# Altium schematic sheet HDMI.SchDoc: HDMI
size A3; Date: 01-DEC-2013; CompanyName: STMicroelectronics; Organization: Microcontrollers Division; Address1: 12, Rue Jules HOROWITZ; Address2: 38019 Grenoble; Address3: FRANCE; DocumentNumber: MB1272; Revision: A-01; SheetNumber: 10; SheetTotal: 18; Project: STM32MP25-DISCO
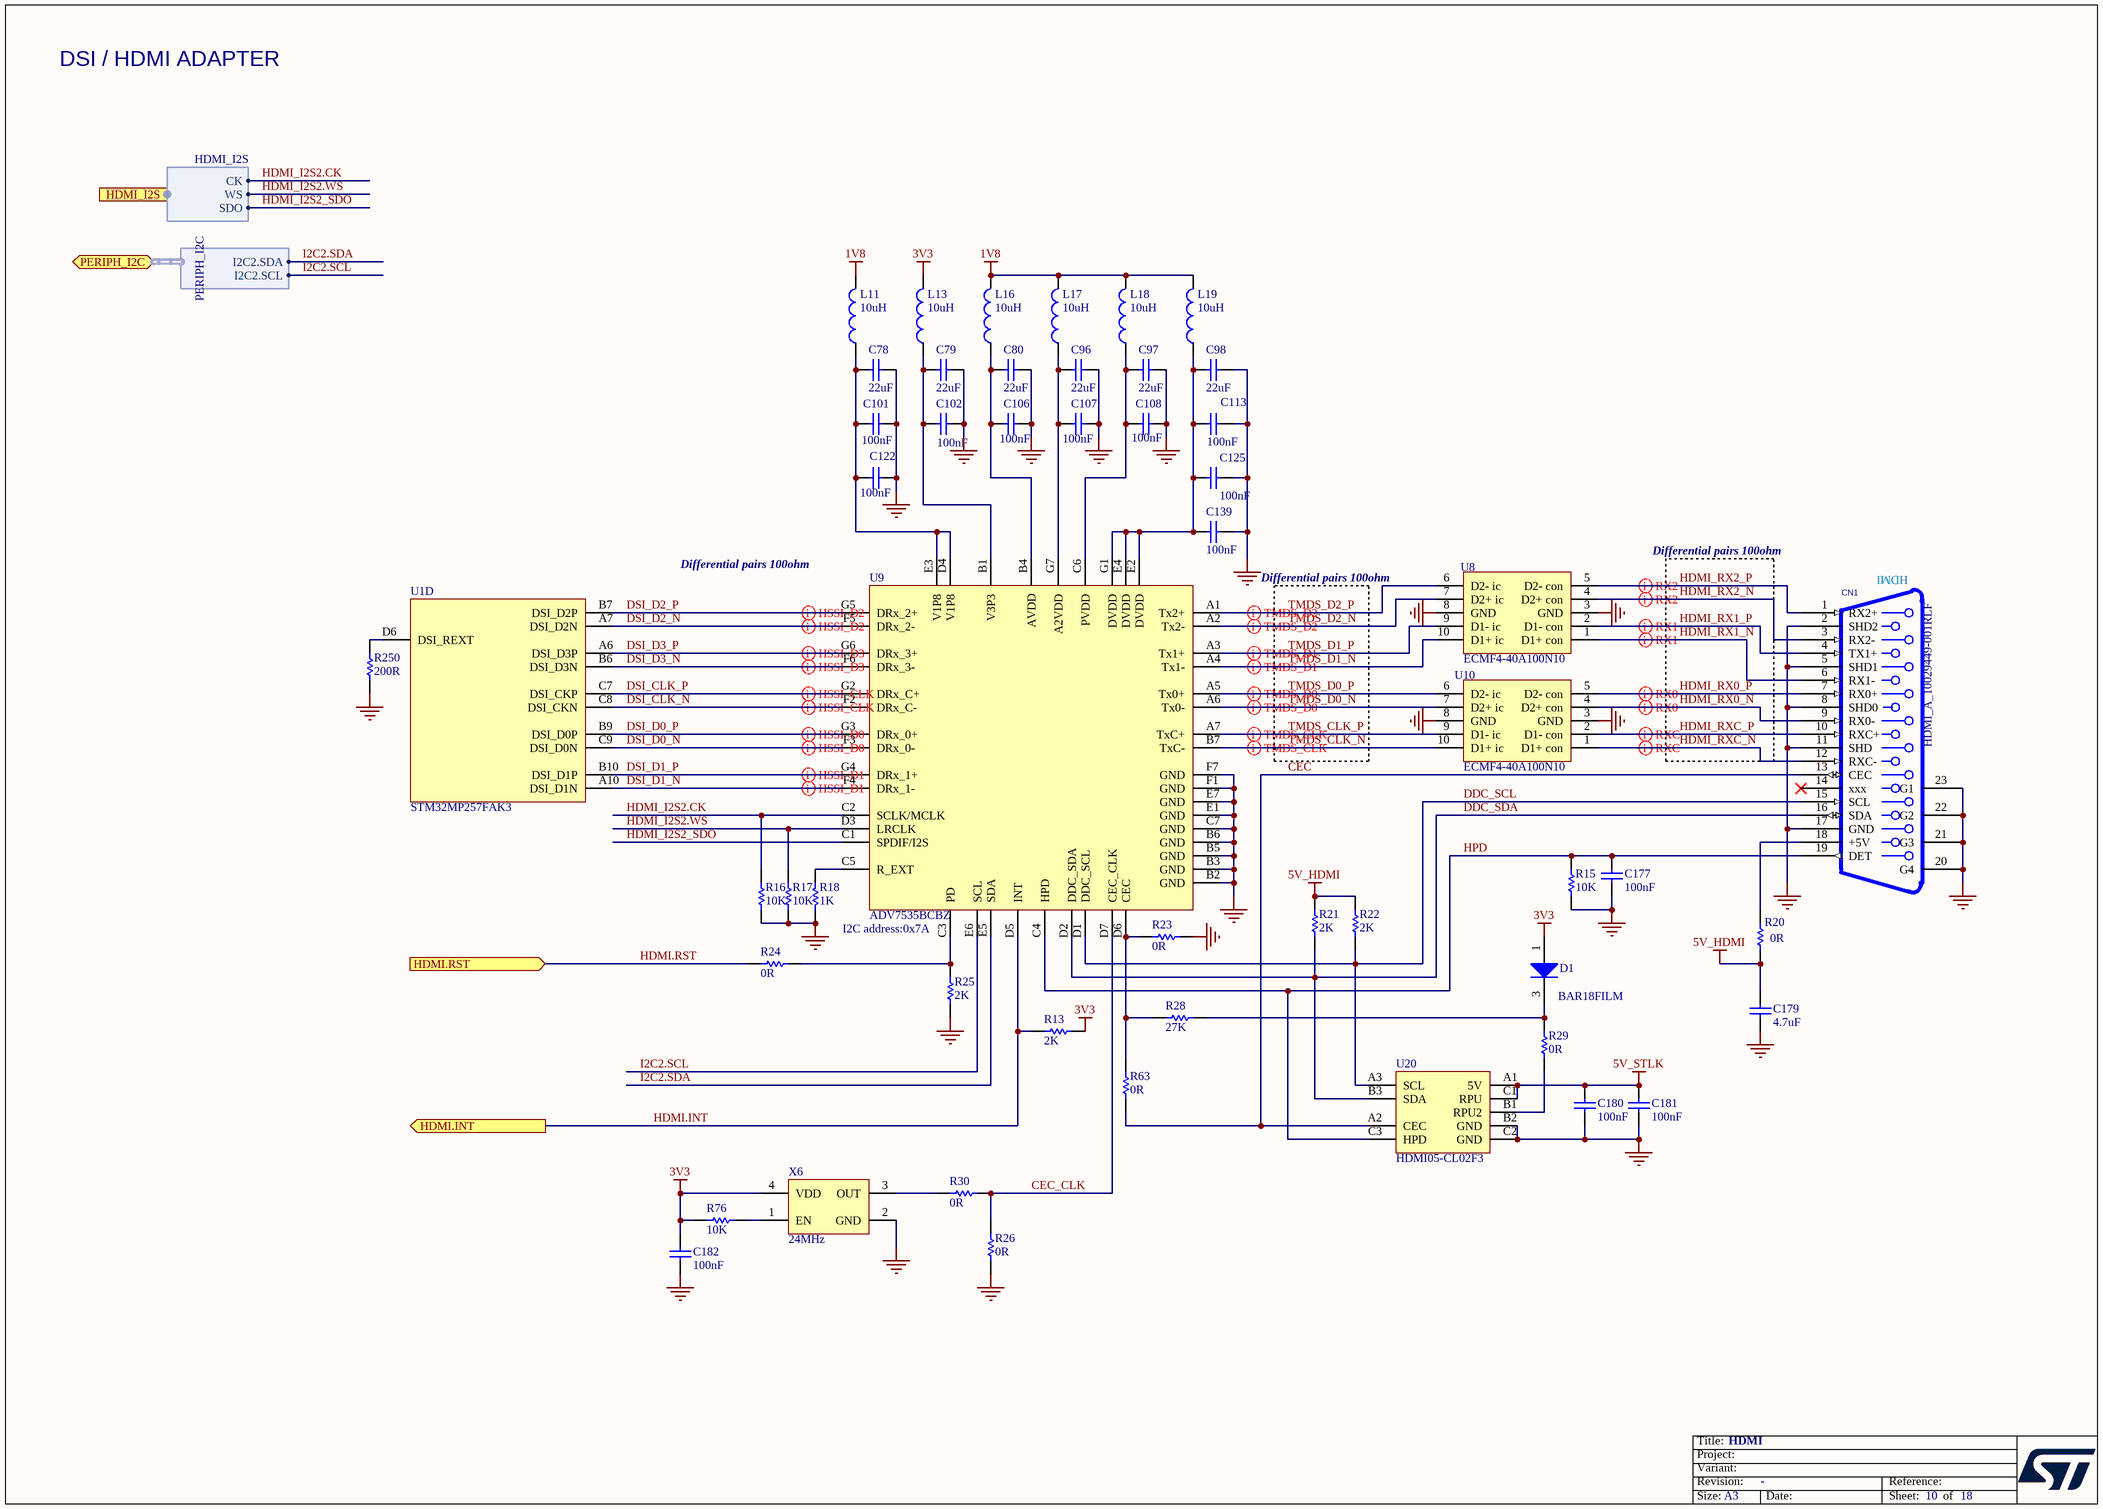
[diagram p0: HDMI.SchDoc]

## Parts
C78  value 22uF  [C0603]  (hidden comment: Capacitor)
C79  value 22uF  [C0603]  (hidden comment: Capacitor)
C80  value 22uF  [C0603]  (hidden comment: Capacitor)
C96  value 22uF  [C0603]  (hidden comment: Capacitor)
C97  value 22uF  [C0603]  (hidden comment: Capacitor)
C98  value 22uF  [C0603]  (hidden comment: Capacitor)
C101  value 100nF  [C0402]  (hidden comment: Capacitor)
C102  value 100nF  [C0402]  (hidden comment: Capacitor)
C106  value 100nF  [C0402]  (hidden comment: Capacitor)
C107  value 100nF  [C0402]  (hidden comment: Capacitor)
C108  value 100nF  [C0402]  (hidden comment: Capacitor)
C113  value 100nF  [C0402]  (hidden comment: Capacitor)
C122  value 100nF  [C0402]  (hidden comment: Capacitor)
C125  value 100nF  [C0402]  (hidden comment: Capacitor)
C139  value 100nF  [C0402]  (hidden comment: Capacitor)
C177  value 100nF  [C0402]  (hidden comment: Capacitor)
C179  value 4.7uF  [C0402]  (hidden comment: Capacitor)
C180  value 100nF  [C0402]  (hidden comment: Capacitor)
C181  value 100nF  [C0402]  (hidden comment: Capacitor)
C182  value 100nF  [C0402]  (hidden comment: Capacitor)
CN1  value HDMI_A_10029449-001RLF  [CON_HDMI_FCI-AMPHENOL_10029449-001RLF]  (hidden comment: HDMI_TypeA_DB19_7)
D1  value BAR18FILM  [DIO_SOT23_SC59_1A_2NC_3K_H1P4]  (hidden comment: DIODE_SOT23)
L11  value 10uH  [IND_0805_MURATA_LQM21]  (hidden comment: Inductor)
L13  value 10uH  [IND_0805_MURATA_LQM21]  (hidden comment: Inductor)
L16  value 10uH  [IND_0805_MURATA_LQM21]  (hidden comment: Inductor)
L17  value 10uH  [IND_0805_MURATA_LQM21]  (hidden comment: Inductor)
L18  value 10uH  [IND_0805_MURATA_LQM21]  (hidden comment: Inductor)
L19  value 10uH  [IND_0805_MURATA_LQM21]  (hidden comment: Inductor)
R13  value 2K  [R0402]  (hidden comment: Resistor)
R15  value 10K  [R0402]  (hidden comment: Resistor)
R16  value 10K  [R0402]  (hidden comment: Resistor)
R17  value 10K  [R0402]  (hidden comment: Resistor)
R18  value 1K  [R0402]  (hidden comment: Resistor)
R20  value 0R  [R0402]  (hidden comment: Resistor)
R21  value 2K  [R0402]  (hidden comment: Resistor)
R22  value 2K  [R0402]  (hidden comment: Resistor)
R23  value 0R  [R0402]  (hidden comment: Resistor)
R24  value 0R  [R0402]  (hidden comment: Resistor)
R25  value 2K  [R0402]  (hidden comment: Resistor)
R26  value 0R  [R0402]  (hidden comment: Resistor)
R28  value 27K  [R0603]  (hidden comment: Resistor)
R29  value 0R  [R0402]  (hidden comment: Resistor)
R30  value 0R  [R0402]  (hidden comment: Resistor)
R63  value 0R  [R0402]  (hidden comment: Resistor)
R76  value 10K  [R0402]  (hidden comment: Resistor)
R250  value 200R  [R0402]  (hidden comment: Resistor)
U1  STM32MP257FAK3  [ICC_TFBGA424_14X14_P050_H1P20_CODE-B0A2]  (part D of 9)
U8  ECMF4-40A100N10  [ESD_UQFN-10L_2P25X1P4_P040]
U9  ADV7535BCBZ  [ICC_WLCSP49_3P46X3P46_P050]
U10  ECMF4-40A100N10  [ESD_UQFN-10L_2P25X1P4_P040]
U20  HDMI05-CL02F3  [ESD_FLIP-CHIP_BGA9_1P14X1P14_P040]
X6  value 24MHz  [CRY_NZ2016SH_4P]  (hidden comment: OSCILLATOR_4_PINS)

## Ports
HDMI.INT (out), HDMI.RST (in), HDMI_I2S (harness HDMI_I2S), PERIPH_I2C (bidir, harness PERIPH_I2C)

## Harnesses
HDMI_I2S: CK, SDO, WS
PERIPH_I2C: I2C2.SDA, I2C2.SCL

## Nets
1V8: L11.2 L16.2 L17.2 L18.2 L19.2
3V3: C182.2 D1.1(A) L13.2 R13.1 R76.1 X6.4(VDD)
5V_HDMI: C179.2 R20.1 R21.2 R22.2
5V_STLK: C180.2 C181.2 U20.A1(5V) U20.C1(RPU)
GND: C78.2 C79.2 C80.2 C96.2 C97.2 C98.2 C101.1 C102.2 C106.2 C107.2 C108.1 C113.1 C122.1 C125.1 C139.1 C177.1 C179.1 C180.1 C181.1 C182.1 CN1.2(SHD2) CN1.5(SHD1) CN1.8(SHD0) CN1.11(SHD) CN1.17(GND) CN1.20(G4) CN1.21(G3) CN1.22(G2) CN1.23(G1) R15.2 R16.1 R17.1 R18.1 R23.2 R25.2 R26.1 R250.2 U8.3(GND) U8.8(GND) U9.B2(GND) U9.B3(GND) U9.B5(GND) U9.B6(GND) U9.C7(GND) U9.E1(GND) U9.E7(GND) U9.F1(GND) U9.F7(GND) U10.3(GND) U10.8(GND) U20.B2(GND) U20.C2(GND) X6.2(GND)
CEC: CN1.13(CEC) R63.1 U20.A2(CEC)
CEC_CLK: R26.2 R30.1 U9.D7(CEC_CLK)
DDC_SCL: CN1.15(SCL) R22.1 U9.D1(DDC_SCL) U20.A3(SCL)
DDC_SDA: CN1.16(SDA) R21.1 U9.D2(DDC_SDA) U20.B3(SDA)
DSI_CLK_N: U1.C8(DSI_CKN) U9.F2(DRx_C-)
DSI_CLK_P: U1.C7(DSI_CKP) U9.G2(DRx_C+)
DSI_D0_N: U1.C9(DSI_D0N) U9.F3(DRx_0-)
DSI_D0_P: U1.B9(DSI_D0P) U9.G3(DRx_0+)
DSI_D1_N: U1.A10(DSI_D1N) U9.F4(DRx_1-)
DSI_D1_P: U1.B10(DSI_D1P) U9.G4(DRx_1+)
DSI_D2_N: U1.A7(DSI_D2N) U9.F5(DRx_2-)
DSI_D2_P: U1.B7(DSI_D2P) U9.G5(DRx_2+)
DSI_D3_N: U1.B6(DSI_D3N) U9.F6(DRx_3-)
DSI_D3_P: U1.A6(DSI_D3P) U9.G6(DRx_3+)
HDMI.INT: R13.2 U9.D5(INT) ; port HDMI.INT
HDMI.RST: R24.1 ; port HDMI.RST
HDMI_I2S2.CK: R16.2 U9.C2(SCLK/MCLK) ; port HDMI_I2S.CK
HDMI_I2S2.WS: R17.2 U9.D3(LRCLK) ; port HDMI_I2S.WS
HDMI_I2S2_SDO: U9.C1(SPDIF/I2S) ; port HDMI_I2S.SDO
HDMI_RX0_N: CN1.9(RX0-) U10.4(D2+_con)
HDMI_RX0_P: CN1.7(RX0+) U10.5(D2-_con)
HDMI_RX1_N: CN1.6(RX1-) U8.1(D1+_con)
HDMI_RX1_P: CN1.4(TX1+) U8.2(D1-_con)
HDMI_RX2_N: CN1.3(RX2-) U8.4(D2+_con)
HDMI_RX2_P: CN1.1(RX2+) U8.5(D2-_con)
HDMI_RXC_N: CN1.12(RXC-) U10.1(D1+_con)
HDMI_RXC_P: CN1.10(RXC+) U10.2(D1-_con)
HPD: C177.2 CN1.19(DET) R15.1 U9.C4(HPD) U20.C3(HPD)
I2C2.SCL: U9.E6(SCL) ; port PERIPH_I2C.I2C2.SCL
I2C2.SDA: U9.E5(SDA) ; port PERIPH_I2C.I2C2.SDA
TMDS_CLK_N: U9.B7(TxC-) U10.10(D1+_ic)
TMDS_CLK_P: U9.A7(TxC+) U10.9(D1-_ic)
TMDS_D0_N: U9.A6(Tx0-) U10.7(D2+_ic)
TMDS_D0_P: U9.A5(Tx0+) U10.6(D2-_ic)
TMDS_D1_N: U8.10(D1+_ic) U9.A4(Tx1-)
TMDS_D1_P: U8.9(D1-_ic) U9.A3(Tx1+)
TMDS_D2_N: U8.7(D2+_ic) U9.A2(Tx2-)
TMDS_D2_P: U8.6(D2-_ic) U9.A1(Tx2+)
NetC78_1: C78.1 C101.2 C122.2 L11.1 U9.D4(V1P8) U9.E3(V1P8)
NetC79_1: C79.1 C102.1 L13.1 U9.B1(V3P3)
NetC80_1: C80.1 C106.1 L16.1 U9.B4(AVDD)
NetC96_1: C96.1 C107.1 L17.1 U9.G7(A2VDD)
NetC97_1: C97.1 C108.2 L18.1 U9.C6(PVDD)
NetC98_1: C98.1 C113.2 C125.2 C139.2 L19.1 U9.E2(DVDD) U9.E4(DVDD) U9.G1(DVDD)
NetCN1_18: CN1.18(+5V) R20.2
NetD1_3: D1.3(K) R28.1 R29.2
NetR18_2: R18.2 U9.C5(R_EXT)
NetR23_1: R23.1 R28.2 R63.2 U9.D6(CEC)
NetR24_2: R24.2 R25.1 U9.C3(PD)
NetR29_1: R29.1 U20.B1(RPU2)
NetR30_2: R30.2 X6.3(OUT)
NetR76_2: R76.2 X6.1(EN)
NetR250_1: R250.1 U1.D6(DSI_REXT)

Not connected (* = marked no-connect by the designer): CN1 14(xxx)*

## Layout directives
differential pair: DSI_CLK_N, DSI_CLK_P, DSI_D0_N, DSI_D0_P, DSI_D1_N, DSI_D1_P, DSI_D2_N, DSI_D2_P, DSI_D3_N, DSI_D3_P, HDMI_RX0_N, HDMI_RX0_P, HDMI_RX1_N, HDMI_RX1_P, HDMI_RX2_N, HDMI_RX2_P, HDMI_RXC_N, HDMI_RXC_P, TMDS_CLK_N, TMDS_CLK_P, TMDS_D0_N, TMDS_D0_P, TMDS_D1_N, TMDS_D1_P, TMDS_D2_N, TMDS_D2_P

## Notes on the sheet
- DSI / HDMI ADAPTER
- (near U9) Differential pairs 100ohm
- Differential pairs 100ohm
- (near CN1) HDMI
- (near U9) I2C address:0x7A
- Title:
- Project:
- Size:
- Revision:
- Variant:
- A3
- -
- Date:
- Reference:
- Sheet:
- of

## Library data of the parts
C78-C80 C96-C98 = MCD-00100: Capacitor, MLCC, 22uF, 6V3, X5R, +/-20%, 0603, T=0.8mm; Part_Preference: Recommended; Manufacturer: MURATA; Manufacturer_Part_Number: GRM188R60J226MEA0J; Component_Country_Of_Origin: Japan; ShowFields: YES; ID: 2766; Internal_Part_Number: MCD-00100; Status: Released; Part_Type: Capacitor; Package: 0603; ComponentLink1URL: http://tunmcdsvn.tun.st.com/Component_Documentation_Library/Trunk/Capacitor/MURATA_GRM_Series; Order_Code_Digikey: 490-7612-2-ND; Order_Code_Farnell: N/A; Order_Code_RS: N/A
C101 C102 C106-C108 C113 C122 C125 C139 = MCD-00006: Capacitor, MLCC, 100nF, 16V, X7R, +/-10%, 0402, T=0.5mm; Part_Preference: Recommended; Manufacturer: YAGEO; Manufacturer_Part_Number: CC0402KRX7R7BB104; Partial_Alternate_Internal_Part_Number: MCD-03299; Order_Code_RS: 616-9701; Component_Country_Of_Origin: China; ShowFields: YES; ID: 2474; Alternate_EMS: M; Internal_Part_Number: MCD-00006; Status: Released; Part_Type: Capacitor; Package: 0402; ComponentLink1URL: http://tunmcdsvn.tun.st.com/Component_Documentation_Library/Trunk/Capacitor/YAGEO_X7R_Series; Order_Code_Digikey: 311-1338-1-ND; Order_Code_Farnell: 9402047
C177 C180-C182 = MCD-00006: Capacitor, MLCC, 100nF, 16V, X7R, +/-10%, 0402, T=0.5mm; Part_Preference: Recommended; Manufacturer: YAGEO; Manufacturer_Part_Number: CC0402KRX7R7BB104; Partial_Alternate_Internal_Part_Number: MCD-03299; Order_Code_RS: 616-9701; Component_Country_Of_Origin: China; ID: 2474; ShowFields: YES; Alternate_EMS: M; Internal_Part_Number: MCD-00006; Status: Released; Part_Type: Capacitor; Package: 0402; ComponentLink1URL: http://tunmcdsvn.tun.st.com/Component_Documentation_Library/Trunk/Capacitor/YAGEO_X7R_Series; Order_Code_Digikey: 311-1338-1-ND; Order_Code_Farnell: 9402047
C179 = MCD-01356: Capacitor, MLCC, 4.7uF, 6V3, X5R, +/-20%, 0402, T=0.5mm; Part_Preference: Recommended; Manufacturer: MURATA; Manufacturer_Part_Number: GRM155R60J475ME47; Order_Code_RS: 814-5230; Component_Country_Of_Origin: Japan; ShowFields: YES; ID: 3456; Internal_Part_Number: MCD-01356; Status: Released; Part_Type: Capacitor; Package: 0402; ComponentLink1URL: http://tunmcdsvn.tun.st.com/Component_Documentation_Library/Trunk/Capacitor/MURATA_GRM_Series; Order_Code_Digikey: 490-5915-1-ND; Order_Code_Farnell: 2666407
CN1 = MCD-00307: HDMI_Type A, Receptacle, 19x1, 0.5mm, VR, SMD, T= 6.1mm; Part_Type: Connector; Part_Preference: Recommended; Manufacturer: AMPHENOL ICC; Manufacturer_Part_Number: 10029449-001RLF; Order_Code_RS: 162-1999; Component_Country_Of_Origin: China; ShowFields: YES; ID: 2561; Internal_Part_Number: MCD-00307; Status: Checked; ComponentLink1URL: http://tunmcdsvn.tun.st.com/Component_Documentation_Library/Trunk/Connector/AMPHENOL_ICC_10029449_Series/; Order_Code_Digikey: 609-1010-2-ND; Order_Code_Farnell: 3367498
D1 = MCD-02333: Diode, Ultrafast and RF switching diode, VF=0.41V@IF=1mA, VBR=70V; Part_Preference: Recommended; Manufacturer: STMICROELECTRONICS; Order_Code_RS: 165-7525; Component_Country_Of_Origin: China; ShowFields: YES; ID: 4439; Internal_Part_Number: MCD-02333; Status: Checked; Part_Type: Diode; Manufacturer_Part_Number: BAR18FILM; Package: SOT-23; ComponentLink1URL: http://tunmcdsvn.tun.st.com/Component_Documentation_Library/Trunk/Diode/STMICROELECTRONICS_BAR18_Series; Order_Code_Digikey: 497-2529-2-ND; Order_Code_Farnell: 9801340RL
L11 L13 L16-L19 = MCD-02317: Inductor, 10uH, +/-20%, Isat 100mA, DCR 0.5Ohm,; Part_Preference: Recommended; Manufacturer: MURATA; Manufacturer_Part_Number: LQM21FN100M80L; Alternate_Manufacturer: TDK; Alternate_Manufacturer_Part_Number: MLZ2012M100WT000; Order_Code_RS: 786-7074; Component_Country_Of_Origin: Japan; ID: 4423; ShowFields: YES; Internal_Part_Number: MCD-02317; Status: Checked; Part_Type: Inductor; Package: 0805; ComponentLink1URL: http://tunmcdsvn.tun.st.com/Component_Documentation_Library/Trunk/Inductor/MURATA_LQM_Series; Order_Code_Digikey: 490-6682-2-ND; Order_Code_Farnell: 2470323
R13 R21 R22 R25 = MCD-00419: Resistor, 2K, 0402, +/-1%, 1/16W; Part_Preference: Recommended; Manufacturer: YAGEO; Manufacturer_Part_Number: RC0402FR-072KL; Component_Country_Of_Origin: China; ID: 2861; ShowFields: YES; Internal_Part_Number: MCD-00419; Status: Released; Part_Type: Resistor; Package: 0402; ComponentLink1URL: http://tunmcdsvn.tun.st.com/Component_Documentation_Library/Trunk/Resistor/YAGEO_RC_L_Series; Order_Code_Digikey: 311-2KLRCT-ND; Order_Code_Farnell: 1458757RL; Order_Code_RS: N/A
R15-R17 R76 = MCD-00053: Resistor, 10K, 0402, +/-1%, 1/16W; Part_Preference: Recommended; Manufacturer: YAGEO; Manufacturer_Part_Number: RC0402FR-0710KL; BMS_Part_Number: 9131590; Component_Country_Of_Origin: China; ID: 2539; ShowFields: YES; Internal_Part_Number: MCD-00053; Status: Released; Part_Type: Resistor; Package: 0402; ComponentLink1URL: http://tunmcdsvn.tun.st.com/Component_Documentation_Library/Trunk/Resistor/YAGEO_RC_L_Series; Order_Code_Digikey: 311-10.0KLRCT-ND; Order_Code_Farnell: 9239359; Order_Code_RS: N/A
R18 = MCD-00061: Resistor, 1K, 0402, +/-1%,1/16W; Part_Preference: Recommended; Manufacturer: YAGEO; Manufacturer_Part_Number: RC0402FR-071KL; Component_Country_Of_Origin: China; ID: 2532; ShowFields: YES; Internal_Part_Number: MCD-00061; Status: Released; Part_Type: Resistor; Package: 0402; ComponentLink1URL: http://tunmcdsvn.tun.st.com/Component_Documentation_Library/Trunk/Resistor/YAGEO_RC_L_Series; Order_Code_Digikey: 311-1.00KLRCT-ND; Order_Code_Farnell: 9239235; Order_Code_RS: N/A
R20 R23 R24 R26 R29 R30 R63 = MCD-00052: Resistor, 0R, 0402, +/-5%, 1/16W; Part_Preference: Recommended; Manufacturer: YAGEO; Manufacturer_Part_Number: RC0402JR-070RL; Order_Code_RS: 618-5804; Component_Country_Of_Origin: China; ShowFields: YES; ID: 2540; Internal_Part_Number: MCD-00052; Status: Released; Part_Type: Resistor; Package: 0402; ComponentLink1URL: http://tunmcdsvn.tun.st.com/Component_Documentation_Library/Trunk/Resistor/YAGEO_RC_L_Series; Order_Code_Digikey: 311-0.0JRCT-ND; Order_Code_Farnell: 9232516RL
R28 = MCD-00444: Resistor, 27K, 0603, +/-1%, 1/10W; Part_Preference: Recommended; Manufacturer: YAGEO; Manufacturer_Part_Number: RC0603FR-0727KL; Component_Country_Of_Origin: China; ShowFields: YES; ID: 2833; Internal_Part_Number: MCD-00444; Status: Released; Part_Type: Resistor; Package: 0603; ComponentLink1URL: http://tunmcdsvn.tun.st.com/Component_Documentation_Library/Trunk/Resistor/YAGEO_RC_L_Series; Order_Code_Digikey: 311-27.0KHRCT-ND; Order_Code_Farnell: 9238654; Order_Code_RS: N/A
R250 = MCD-00417: Resistor, 200R, 0402, +/-1%, 1/16W; Manufacturer_Part_Number: RC0402FR-07200RL; Manufacturer: YAGEO; Part_Preference: Recommended; Component_Country_Of_Origin: China; ID: 2860; ShowFields: YES; Internal_Part_Number: MCD-00417; Status: Released; Part_Type: Resistor; Package: 0402; ComponentLink1URL: http://tunmcdsvn.tun.st.com/Component_Documentation_Library/Trunk/Resistor/YAGEO_RC_L_Series; Order_Code_Digikey: 311-200LRCT-ND; Order_Code_Farnell: 1458756; Order_Code_RS: N/A
U1 = MCD-03375: MPU , 2xCortex-A35@1.5GHz, Cortex-M33@400MHz, TFBGA 14x14, pitch 0.5, 648KB SRAM, With Crypto; Part_Type: IC; Part_Preference: Recommended; Manufacturer: STMICROELECTRONICS; Component_Country_Of_Origin: Unknown; ShowFields: YES; ID: 5491; Value: STM32MP257FAK3; Internal_Part_Number: MCD-03375; Status: Checked; Manufacturer_Part_Number: STM32MP257FAK3; Package: TFBGA; ComponentLink1URL: http://tunmcdsvn.tun.st.com/Component_Documentation_Library/Trunk/IC/STMICROELECTRONICS_STM32MP257FAK3; Order_Code_Digikey: N/A; Order_Code_Farnell: N/A; Order_Code_RS: N/A
U8 U10 = MCD-03059: ESD protection & Common Filter High Speed serial Interfaces , 0.4 pitch; Part_Type: IC; Part_Preference: Recommended; Manufacturer: STMICROELECTRONICS; ShowFields: YES; ID: 5175; Component_Country_Of_Origin: China; ComponentLink1Description: Datasheet; ComponentLink1URL: http://tunmcdsvn.tun.st.com/Component_Documentation_Library/Trunk/IC/STMICROELECTRONICS_ECMF4-40A100N10; Internal_Part_Number: MCD-03059; Value: ECMF4-40A100N10; Status: Checked; Manufacturer_Part_Number: ECMF4-40A100N10; Package: uQFN-10L; Order_Code_Digikey: 497-ECMF4-40A100N10; Order_Code_Farnell: N/A; Order_Code_RS: N/A
U9 = MCD-02315: MIPI/DSI Receiver with HDMI Transmitter; Part_Type: IC; Part_Preference: Recommended; Manufacturer: ANALOG DEVICES; Component_Country_Of_Origin: Singapore; ShowFields: YES; ID: 4421; Value: ADV7535BCBZ; Order_code_Digikey: N/A; Order_code_Farnell: N/A; Order_code_RS: N/A; Status: Checked; ComponentLink1URL: http://tunmcdsvn.tun.st.com/Component_Documentation_Library/Trunk/IC/ANALOG_DEVICES_ADV7535BCBZ; Internal_Part_Number: MCD-02315; Manufacturer_Part_Number: ADV7535BCBZ; Package: WLCSP-49 pitch 0.5mm
U20 = MCD-02316: 5-line HDMI control line ESD protection; Part_Type: IC; Part_Preference: Recommended; Manufacturer: STMICROELECTRONICS; Component_Country_Of_Origin: France; ShowFields: YES; ID: 4422; Value: HDMI05-CL02F3; Order_code_Digikey: 497-8885-2-ND; Order_code_Farnell: 3130057RL; Order_code_RS: N/A; Status: Checked; ComponentLink1URL: http://tunmcdsvn.tun.st.com/Component_Documentation_Library/Trunk/IC/STMICROELECTRONICS_HDMI05-CL02F3; Internal_Part_Number: MCD-02316; Manufacturer_Part_Number: HDMI05-CL02F3; Package: Flip Chip 9 bumps 0.4 mm pitch
X6 = MCD-01627: Oscillator, SPXO, 24MHz, +/-50ppm, square wave, 3V3, 2x1.6mm; BMS_Part_Number: 9157051; Part_Type: Crystal_Osc; Part_Preference: Recommended; Manufacturer: NDK; Manufacturer_Part_Number: NZ2016SH-24MHZ-END4869F; Component_Country_Of_Origin: Unknown; ShowFields: YES; ID: 3727; Internal_Part_Number: MCD-01627; Status: Released; Package: 2x1.6mm; ComponentLink1URL: http://tunmcdsvn.tun.st.com/Component_Documentation_Library/Trunk/Crytal_Oscillator/NDK_NZ2016SH_Series; Order_Code_Digikey: N/A; Order_Code_Farnell: N/A; Order_Code_RS: N/A